# EAGLE design res-standalone (EAGLE 6.5.0)
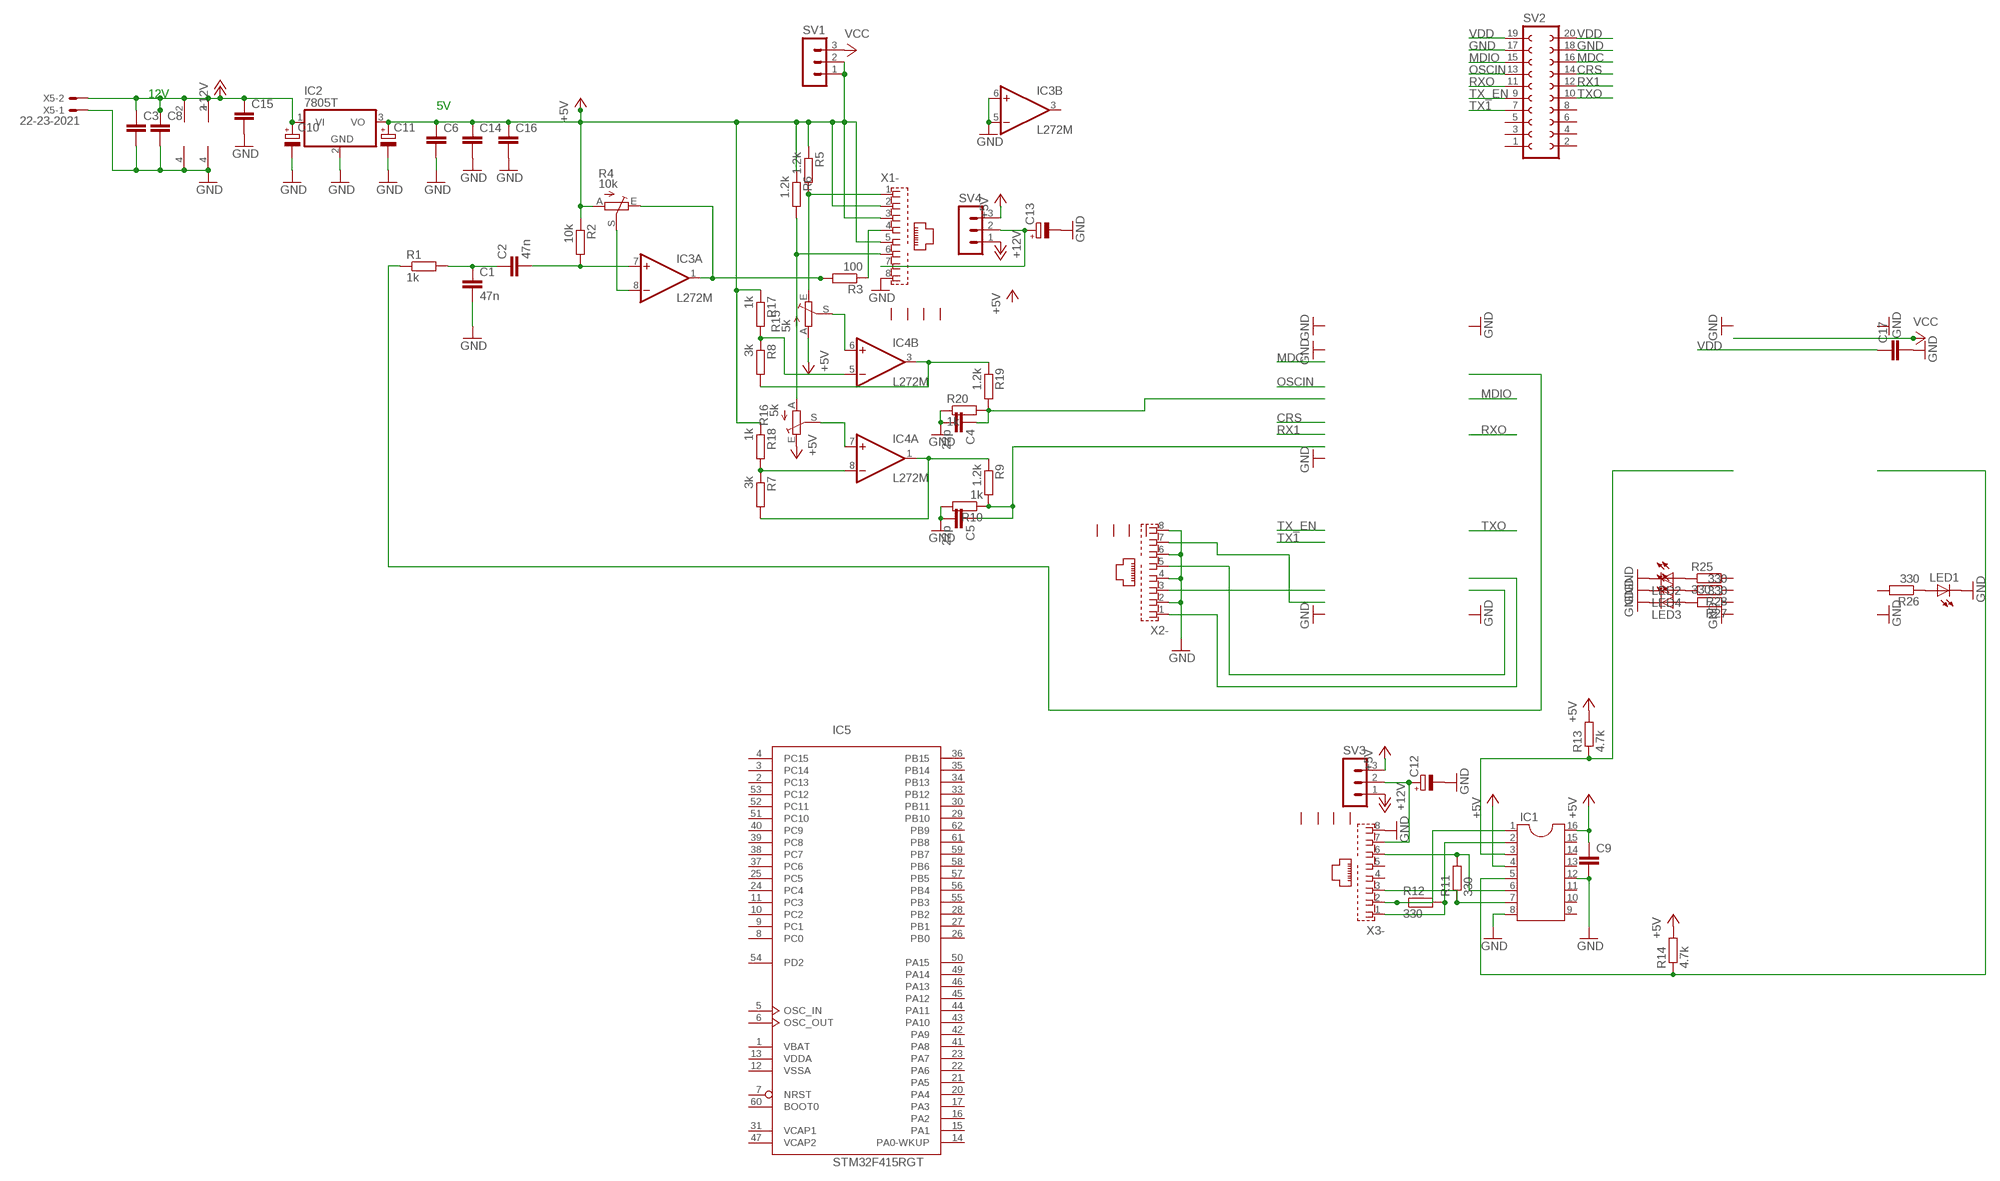
[diagram p0: schematic, sheet 1]

## Parts
C1  47n  C-EU050-025X075  [C050-025X075]
C2  47n  C-EU050-025X075  [C050-025X075]
C3  C-EU050-025X075  [C050-025X075]
C4  22p  C-EU050-025X075  [C050-025X075]
C5  22p  C-EU050-025X075  [C050-025X075]
C6  C-EU050-025X075  [C050-025X075]
C8  C-EU050-025X075  [C050-025X075]
C9  C-EU050-025X075  [C050-025X075]
C10  CPOL-EUE2.5-5  [E2,5-5]
C11  CPOL-EUE2.5-5  [E2,5-5]
C12  CPOL-EUE2.5-5  [E2,5-5]
C13  CPOL-EUE2.5-5  [E2,5-5]
C14  C-EU050-025X075  [C050-025X075]
C15  C-EU050-025X075  [C050-025X075]
C16  C-EU050-025X075  [C050-025X075]
C17  C-EU050-025X075  [C050-025X075]
IC1  DIL16  [DIL16]
IC2  7805T  [TO220H]
IC3  L272M  [DIL08]
IC4  L272M  [DIL08]
IC5  STM32F415RGT  [LQFP64]
LED1  LED3MM  [LED3MM]
LED2  LED3MM  [LED3MM]
LED3  LED3MM  [LED3MM]
LED4  LED3MM  [LED3MM]
R1  1k  R-EU_0204/7  [0204/7]
R2  10k  R-EU_0204/7  [0204/7]
R3  100  R-EU_0204/7  [0204/7]
R4  10k  TRIM_EU-CA6V  [CA6V]
R5  1.2k  R-EU_0204/7  [0204/7]
R6  1.2k  R-EU_0204/7  [0204/7]
R7  3k  R-EU_0204/7  [0204/7]
R8  3k  R-EU_0204/7  [0204/7]
R9  1.2k  R-EU_0204/7  [0204/7]
R10  1k  R-EU_0204/7  [0204/7]
R11  330  R-EU_0204/7  [0204/7]
R12  330  R-EU_0204/7  [0204/7]
R13  4.7k  R-EU_0204/7  [0204/7]
R14  4.7k  R-EU_0204/7  [0204/7]
R15  5k  TRIM_EU-CA6V  [CA6V]
R16  5k  TRIM_EU-CA6V  [CA6V]
R17  1k  R-EU_0204/7  [0204/7]
R18  1k  R-EU_0204/7  [0204/7]
R19  1.2k  R-EU_0204/7  [0204/7]
R20  1k  R-EU_0204/7  [0204/7]
R25  330  R-EU_0204/7  [0204/7]
R26  330  R-EU_0204/7  [0204/7]
R27  330  R-EU_0204/7  [0204/7]
R28  330  R-EU_0204/7  [0204/7]
SV1  MA03-1  [MA03-1]
SV2  FE10-2W  [FE10-2W]
SV3  MA03-1  [MA03-1]
SV4  MA03-1  [MA03-1]
X1  RJ45  [RJ45]
X2  RJ45  [RJ45]
X3  RJ45  [RJ45]
X5  22-23-2021  [22-23-2021]

## Nets
+5V: C6.1 C9.1 C11.+ C14.1 C16.1 IC1.4 IC1.16 IC2.3(VO) R2.1 R4.A R5.1 R6.1 R13.2 R14.2 R15.A R16.E R17.1 R18.1 SV1.1 SV1.2 SV3.3 SV4.3 X1.2 X1.3 X1.5
+12V: C3.1 C8.1 C10.+ C15.1 IC2.1(VI) IC3.2(P:V+) IC4.2(P:V+) SV3.1 SV4.1 X5.2
CRS: SV2.14
GND: C1.2 C3.2 C4.2 C5.2 C6.2 C8.2 C9.2 C10.- C11.- C12.- C13.- C14.2 C15.2 C16.2 C17.2 IC1.8 IC1.12 IC2.2(GND) IC3.4(P:GND) IC3.5(B:-IN) IC3.6(B:+IN) IC4.4(P:GND) LED1.K(C) LED2.K(C) LED3.K(C) LED4.K(C) R10.2 R20.1 SV2.17 SV2.18 X1.8 X2.2 X2.4 X2.6 X2.8 X3.8 X5.1
MDC: SV2.16
MDIO: SV2.15
N$1: IC3.8(A:-IN) R4.S
N$2: IC3.1(A:OUT) R3.2 R4.E
N$3: C2.2 IC3.7(A:+IN) R2.2
N$4: R1.1
N$5: C1.1 C2.1 R1.2
N$6: R3.1 X1.4
N$8: R6.2 R16.A X1.6
N$9: R5.2 R15.E X1.1
N$10: IC4.5(B:-IN) R8.1 R17.2
N$11: IC4.8(A:-IN) R7.1 R18.2
N$12: IC4.3(B:OUT) R8.2 R19.1
N$13: IC4.1(A:OUT) R7.2 R9.1
N$14: X2.7
N$15: C12.+ SV3.2 X3.7
N$16: X2.1
N$17: IC1.6 R11.2 X3.6
N$18: X2.5
N$19: X2.3
N$20: C4.1 R19.2 R20.2
N$21: IC4.6(B:+IN) R15.S
N$22: IC1.3 R13.1
N$23: IC1.5 R14.1
N$24: IC1.2 R12.2 X3.1
N$25: IC1.1 R12.1 X3.2
N$26: IC1.7 R11.1 X3.3
N$27: C13.+ SV4.2 X1.7
N$28: IC4.7(A:+IN) R16.S
N$40: C5.1 R9.2 R10.1
N$46: LED2.A R25.1
N$50: LED1.A R26.1
N$52: LED3.A R27.2
N$53: LED4.A R28.2
OSCIN: SV2.13
RX1: SV2.12
RXO: SV2.11
TX1: SV2.7
TX_EN: SV2.9
TXO: SV2.10
VCC: SV1.3
VDD: C17.1 SV2.19 SV2.20
Unconnected: IC1.9 IC1.10 IC1.11 IC1.13 IC1.14 IC1.15 IC3.3(B:OUT) IC5.2(PC13) IC5.3(PC14) IC5.4(PC15) IC5.5(OSC_IN) IC5.6(OSC_OUT) IC5.7(NRST) IC5.8(PC0) IC5.9(PC1) IC5.10(PC2) IC5.11(PC3) IC5.14(PA0-WKUP) IC5.15(PA1) IC5.16(PA2) IC5.17(PA3) IC5.20(PA4) IC5.21(PA5) IC5.22(PA6) IC5.23(PA7) IC5.24(PC4) IC5.25(PC5) IC5.26(PB0) IC5.27(PB1) IC5.28(PB2) IC5.29(PB10) IC5.30(PB11) IC5.33(PB12) IC5.34(PB13) IC5.35(PB14) IC5.36(PB15) IC5.37(PC6) IC5.38(PC7) IC5.39(PC8) IC5.40(PC9) IC5.41(PA8) IC5.42(PA9) IC5.43(PA10) IC5.44(PA11) IC5.45(PA12) IC5.46(PA13) IC5.49(PA14) IC5.50(PA15) IC5.51(PC10) IC5.52(PC11) IC5.53(PC12) IC5.54(PD2) IC5.55(PB3) IC5.56(PB4) IC5.57(PB5) IC5.58(PB6) IC5.59(PB7) IC5.60(BOOT0) IC5.61(PB8) IC5.62(PB9) R25.2 R26.2 R27.1 R28.1 SV2.1 SV2.2 SV2.3 SV2.4 SV2.5 SV2.6 SV2.8 X1.G1 X1.G2 X1.G3 X1.G4 X2.G1 X2.G2 X2.G3 X2.G4 X3.4 X3.5 X3.G1 X3.G2 X3.G3 X3.G4

## Notes on the sheet
- 12V
- 5V

## Power pins joined to a net without a drawn wire
VBAT: IC5.1(VBAT)
VCAP1: IC5.31(VCAP1)
VCAP2: IC5.47(VCAP2)
VDD: IC5.19(VDD) IC5.32(VDD) IC5.48(VDD) IC5.64(VDD)
VDDA: IC5.13(VDDA)
VSS: IC5.18(VSS) IC5.63(VSS)
VSSA: IC5.12(VSSA)

## Library data of the parts
C1-C6 C8 C9 C14-C17 = rcl:C-EU: CAPACITOR, European symbol
C10-C13 = rcl:CPOL-EU: POLARIZED CAPACITOR, European symbol
IC1 = ic-package:DIL16: Dual In Line / Socket
IC2 = linear:78*: Positive VOLTAGE REGULATOR Source: http://cache.national.com/ds/LM/LM78L05.pdf http://www.fairchildsemi.com/ds/LM/LM7805.pdf
IC3 IC4 = linear:L272: OP AMP
IC5 = micro-stm_v2:STM32F415R*T: ARM 32-bit Cortex™-M3 CPU 168 MHz maximum frequency 1024 Kbytes of Flash memory 192 kbytes of SRAM 51 GPIOs 1.8 to 3.6 V application supply
LED1-LED4 = led:LED: LED OSRAM: - CHIPLED LG R971, LG N971, LY N971, LG Q971, LY Q971, LO R971, LY R971 LH N974, LH R974 LS Q976, LO Q976, LY Q976 LO Q996 - Hyper CHIPLED LW Q18S LB Q993, LB Q99A, LB R99A - SideLED LS A670, LO A670, LY A670, LG A670, LP A670 LB A673, LV A673, LT A673, LW A673 LH A674 LY A675 LS A676, LA A676, LO A676, LY A676, LW A676 LS A679, LY A679, LG A679 - Hyper Micro SIDELED® LS Y876, LA Y876, LO Y876, LY Y876 LT Y87S - SmartLED LW L88C, LW L88S LB L89C, LB L89S, LG L890 LS L89K, LO L89K, LY L89K LS L896, LA L896, LO L896, LY L896 - TOPLED LS T670, LO T670, LY T670, LG T670, LP T670 LSG T670, LSP T670, LSY T670, LOP T670, LYG T670 LG T671, LOG T671, LSG T671 LB T673, LV T673, LT T673, LW T673 LH T674 LS T676, LA T676, LO T676, LY T676, LB T676, LH T676, LSB T676, LW T676 LB T67C, LV T67C, LT T67C, LS T67K, LO T67K, LY T67K, LW E67C LS E67B, LA E67B, LO E67B, LY E67B, LB E67C, LV E67C, LT E67C LW T67C LS T679, LY T679, LG T679 LS T770, LO T770, LY T770, LG T770, LP T770 LB T773, LV T773, LT T773, LW T773 LH T774 LS E675, LA E675, LY E675, LS T675 LS T776, LA T776, LO T776, LY T776, LB T776 LHGB T686 LT T68C, LB T68C - Hyper Mini TOPLED® LB M676 - Mini TOPLED Santana® LG M470 LS M47K, LO M47K, LY M47K Source: http://www.osram.convergy.de LUXEON: - LUMILED® LXK2-PW12-R00, LXK2-PW12-S00, LXK2-PW14-U00, LXK2-PW14-V00 LXK2-PM12-R00, LXK2-PM12-S00, LXK2-PM14-U00 LXK2-PE12-Q00, LXK2-PE12-R00, LXK2-PE12-S00, LXK2-PE14-T00, LXK2-PE14-U00 LXK2-PB12-K00, LXK2-PB12-L00, LXK2-PB12-M00, LXK2-PB14-N00, LXK2-PB14-P00, LXK2-PB14-Q00 LXK2-PR12-L00, LXK2-PR12-M00, LXK2-PR14-Q00, LXK2-PR14-R00 LXK2-PD12-Q00, LXK2-PD12-R00, LXK2-PD12-S00 LXK2-PH12-R00, LXK2-PH12-S00 LXK2-PL12-P00, LXK2-PL12-Q00, LXK2-PL12-R00 Source: www.luxeon.com KINGBRIGHT: KA-3528ASYC Source: www.kingbright.com
R1-R3 R5-R14 R17-R20 R25-R28 = resistor:R-EU_: RESISTOR, European symbol
R4 R15 R16 = pot:TRIM_EU-: POTENTIOMETER
SV1 SV3 SV4 = con-lstb:MA03-1: PIN HEADER; OC_FARNELL: unknown; OC_NEWARK: unknown
SV2 = con-lsta:FE10-2W: FEMALE HEADER; OC_FARNELL: unknown; OC_NEWARK: unknown
X1-X3 = con-appsys:RJ45: AMP connector
X5 = con-molex:22-23-2021: .100" (2.54mm) Center Header - 2 Pin; MF: MOLEX; MPN: 22-23-2021; OC_FARNELL: 1462926; OC_NEWARK: 25C3832

## Net classes
0 default: clearance 0.205 mm

## Board
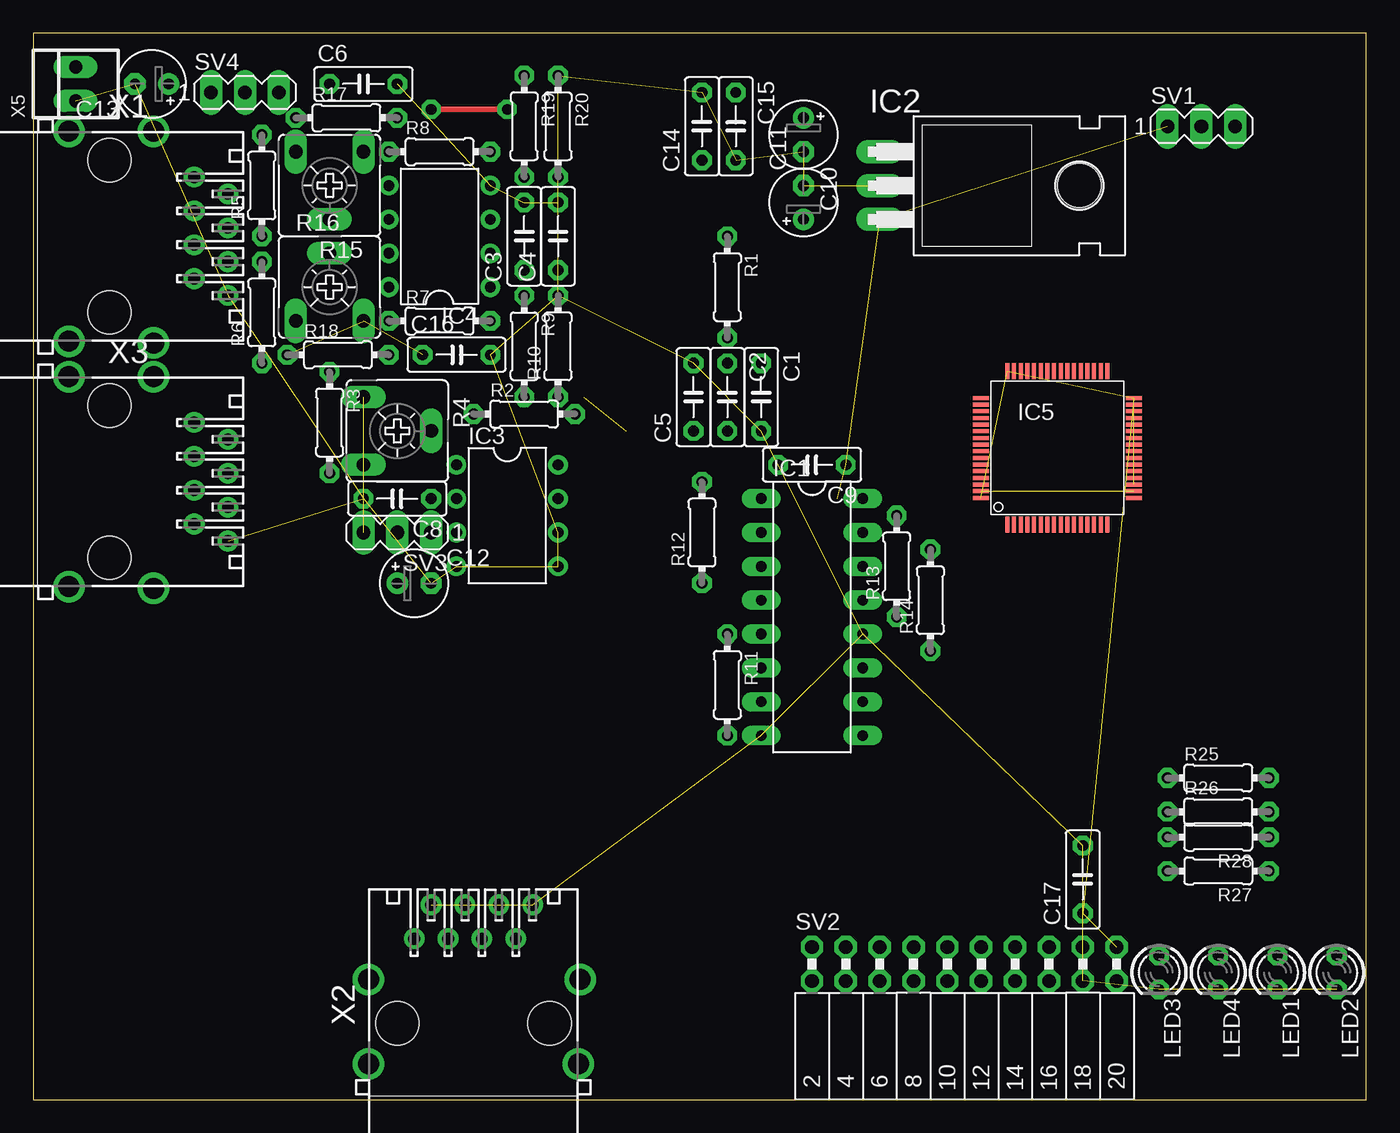
[diagram p1: board, top side]
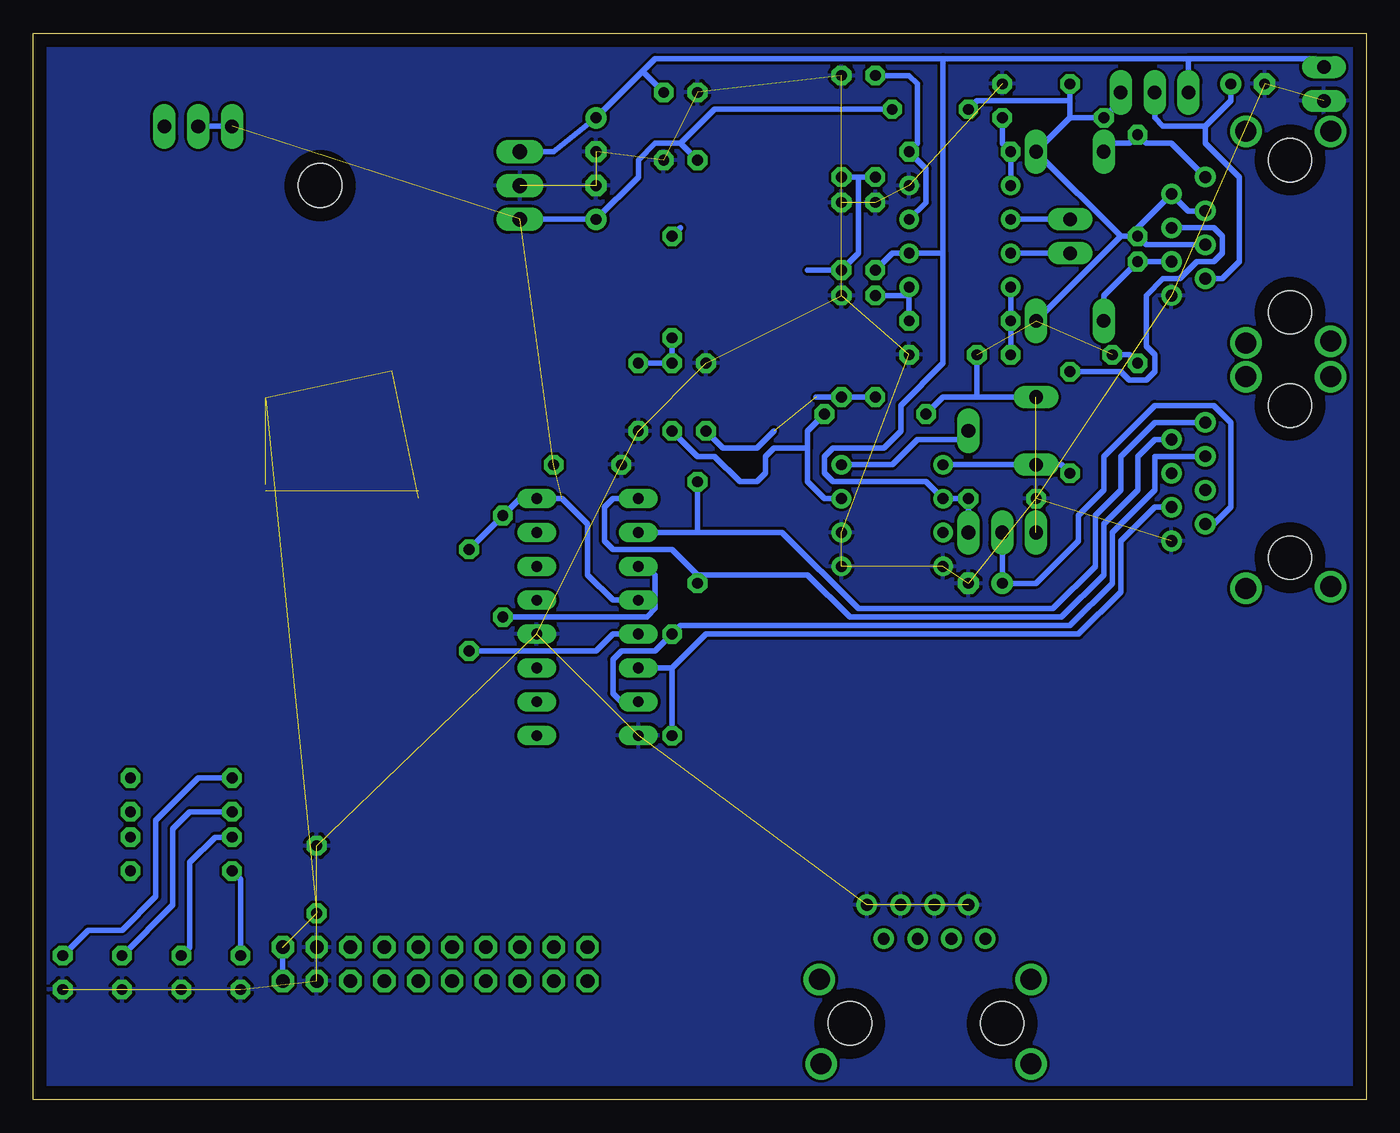
[diagram p2: board, bottom side, seen from below]

Size 100 x 80 mm. Coordinates in mm from the lower left corner, seen from the top.
Outline: 0,0 100,0 100,80 0,80 0,0
Copper layers (1*16): Top 0.035mm / dielectric 1.5mm / Bottom 0.035mm
Design rules "default *": minimum track width 10mil, minimum drill 31mil, track to track 8mil, track to pad 8mil, pad to pad 8mil, via to via 8mil, smd to smd 8mil, copper to edge 40mil, drill to drill 8mil, minimum pad ring 13mil, minimum via ring 8mil, stop-mask expansion 4mil, vias tented up to drill 0mil, thermal gap 10mil

### Footprints (pad centres in the part's own frame; a part is rotated, then mirrored left to right if it is on the bottom)
C050-025X075 = drill 0.813 octagon: 1 -2.54,0; 2 2.54,0
E2,5-5 = drill 0.813 pad 1.6: + -1.27,0 | drill 0.813 pad 1.6 octagon: - 1.27,0
DIL16 = drill 0.813 long: 1 -8.89,-3.81; 2 -6.35,-3.81; 3 -3.81,-3.81; 4 -1.27,-3.81; 5 1.27,-3.81; 6 3.81,-3.81; 7 6.35,-3.81; 8 8.89,-3.81; 9 8.89,3.81; 10 6.35,3.81; 11 3.81,3.81; 12 1.27,3.81; 13 -1.27,3.81; 14 -3.81,3.81; 15 -6.35,3.81; 16 -8.89,3.81
TO220H = drill 1.118 long: 1 -2.54,-10.16; 2 0,-10.16; 3 2.54,-10.16 | hole 3.302: 0,4.826
DIL08 = drill 0.813 pad 1.27: 1 -3.81,-3.81; 2 -1.27,-3.81; 3 1.27,-3.81; 4 3.81,-3.81; 5 3.81,3.81; 6 1.27,3.81; 7 -1.27,3.81; 8 -3.81,3.81
LQFP64 = smd 0.3 x 1.2: 1 -3.75,-5.75; 2 -3.25,-5.75; 3 -2.75,-5.75; 4 -2.25,-5.75; 5 -1.75,-5.75; 6 -1.25,-5.75; 7 -0.75,-5.75; 8 -0.25,-5.75; 9 0.25,-5.75; 10 0.75,-5.75; 11 1.25,-5.75; 12 1.75,-5.75; 13 2.25,-5.75; 14 2.75,-5.75; 15 3.25,-5.75; 16 3.75,-5.75; 33 3.75,5.75; 34 3.25,5.75; 35 2.75,5.75; 36 2.25,5.75; 37 1.75,5.75; 38 1.25,5.75; 39 0.75,5.75; 40 0.25,5.75; 41 -0.25,5.75; 42 -0.75,5.75; 43 -1.25,5.75; 44 -1.75,5.75; 45 -2.25,5.75; 46 -2.75,5.75; 47 -3.25,5.75; 48 -3.75,5.75 | smd 1.2 x 0.3: 17 5.75,-3.75; 18 5.75,-3.25; 19 5.75,-2.75; 20 5.75,-2.25; 21 5.75,-1.75; 22 5.75,-1.25; 23 5.75,-0.75; 24 5.75,-0.25; 25 5.75,0.25; 26 5.75,0.75; 27 5.75,1.25; 28 5.75,1.75; 29 5.75,2.25; 30 5.75,2.75; 31 5.75,3.25; 32 5.75,3.75; 49 -5.75,3.75; 50 -5.75,3.25; 51 -5.75,2.75; 52 -5.75,2.25; 53 -5.75,1.75; 54 -5.75,1.25; 55 -5.75,0.75; 56 -5.75,0.25; 57 -5.75,-0.25; 58 -5.75,-0.75; 59 -5.75,-1.25; 60 -5.75,-1.75; 61 -5.75,-2.25; 62 -5.75,-2.75; 63 -5.75,-3.25; 64 -5.75,-3.75
LED3MM = drill 0.813 octagon: A -1.27,0; K 1.27,0
0204/7 = drill 0.813 octagon: 1 -3.81,0; 2 3.81,0
CA6V = drill 1.016 long: A -2.54,-2.54; E 2.54,-2.54; S 0,2.54
MA03-1 = drill 1.016 long: 1 -2.54,0; 2 0,0; 3 2.54,0
FE10-2W = drill 1.016 octagon: 1 -11.43,1.27; 2 -11.43,-1.27; 3 -8.89,1.27; 4 -8.89,-1.27; 5 -6.35,1.27; 6 -6.35,-1.27; 7 -3.81,1.27; 8 -3.81,-1.27; 9 -1.27,1.27; 10 -1.27,-1.27; 11 1.27,1.27; 12 1.27,-1.27; 13 3.81,1.27; 14 3.81,-1.27; 15 6.35,1.27; 16 6.35,-1.27; 17 8.89,1.27; 18 8.89,-1.27; 19 11.43,1.27; 20 11.43,-1.27
RJ45 = drill 0.889: 1 -4.445,6.35; 2 -3.175,8.89; 3 -1.905,6.35; 4 -0.635,8.89; 5 0.635,6.35; 6 1.905,8.89; 7 3.175,6.35; 8 4.445,8.89 | drill 1.575 pad 2.184: G1 -7.874,-3.048; G2 7.874,-3.048; G3 -7.874,3.302; G4 8.001,3.302 | hole 3.251: -5.715,0; 5.715,0
22-23-2021 = drill 1 long: 1 -1.27,0; 2 1.27,0

### Placement (x,y rotation side)
C1  54.61,52.7 270 top
C2  52.07,52.7 270 top
C3  36.83,64.77 90 top
C4  39.37,64.77 90 top
C5  49.53,52.7 90 top
C6  24.77,76.2 0 top
C8  27.3,45.08 180 top
C9  58.42,47.62 180 top
C10  57.78,72.39 270 top
C11  57.78,67.31 90 top
C12  28.57,38.73 0 top
C13  8.89,76.2 180 top
C14  50.16,73.03 90 top
C15  52.7,73.03 270 top
C16  31.75,55.88 0 top
C17  78.74,16.51 90 top
IC1  58.42,36.2 270 top
IC2  73.66,68.58 270 top
IC3  35.56,43.81 270 top
IC4  30.48,64.77 90 top
IC5  76.83,48.89 0 top
LED1  93.34,9.53 270 top
LED2  97.79,9.53 270 top
LED3  84.45,9.53 270 top
LED4  88.9,9.53 270 top
R1  52.07,60.96 270 top
R2  36.83,51.43 0 top
R3  22.23,50.8 270 top
R4  27.3,50.16 270 top
R5  17.14,68.58 90 top
R6  17.14,59.05 90 top
R7  30.48,58.42 0 top
R8  30.48,71.12 0 top
R9  36.83,56.51 270 top
R10  39.37,56.51 90 top
R11  52.07,31.11 270 top
R12  50.16,42.54 90 top
R13  64.77,40 90 top
R14  67.31,37.46 90 top
R15  22.23,68.58 180 top
R16  22.23,60.96 0 top
R17  23.5,73.66 0 top
R18  22.86,55.88 0 top
R19  36.83,73.03 270 top
R20  39.37,73.03 270 top
R25  88.9,24.13 0 top
R26  88.9,21.59 0 top
R27  88.9,17.14 180 top
R28  88.9,19.68 180 top
SV1  87.63,73.03 0 top
SV2  69.85,10.16 0 top
SV3  27.3,42.54 180 top
SV4  15.88,75.56 0 top
X1  5.71,64.77 270 top
X2  33.02,5.71 0 top
X3  5.71,46.35 270 top
X5  3.17,76.2 90 top

### Tracks (layer width: path | path; a pad name or v marks a point on that pad's centre or on a via)
+5V  (via drill 0.8 pad 1.42)  (6 unrouted)
  Top 0.406: v35.56,74.3 v29.84,74.3
  Bottom 0.406: SV1.2 SV1.1 | IC1.4 56.52,37.46 58.42,39.37 58.42,43.18 60.33,45.08 IC1.16 63.5,45.08 R13.2 R14.2 | X1.3 13.34,66.67 X1.2 17.78,64.77 | 17.78,64.77 18.41,64.77 | X1.5 16.51,64.14 R5.1 17.78,64.77 | R18.1 17.78,55.88 R6.1 | 22.23,73.66 22.23,74.93 | 22.23,74.93 C6.1 | IC2.3 C11.+ 54.61,69.22 54.61,70.48 53.34,71.76 51.44,71.76 | R2.1 31.75,52.7 29.21,52.7 | C14.1 51.44,71.76 | 51.44,71.76 48.9,74.3 v35.56,74.3 | SV4.3 18.41,74.93 R17.1 22.23,73.66 | R4.A 29.21,52.7 | 22.23,74.93 29.21,74.93 v29.84,74.3 | C16.1 29.21,52.7 | 22.23,73.66 R15.A 18.41,64.77 | 18.41,64.77 R16.E
+12V
  Bottom 0.406: SV3.1 C8.1 IC3.2 33.02,46.35 40.01,46.35 40.64,46.99 40.64,48.26 40.01,48.89 36.2,48.89 34.92,50.16 34.92,52.07 31.75,55.24 31.75,63.5 | 31.75,63.5 31.75,78.11 | IC2.1 60.96,71.12 C10.+ 54.29,77.15 | 54.29,77.15 53.34,78.11 31.75,78.11 | 31.75,63.5 IC4.2 35.56,63.5 C3.1 | 31.75,78.11 13.34,78.11 | 13.34,78.11 SV4.1 | C15.1 54.29,77.15 | X5.2 3.81,78.11 13.34,78.11
GND  (36 unrouted)
  pour Bottom: 0,80.65 101.6,80.65 100.97,-0.64 -0.64,-0.64
N$1
  Bottom 0.406: IC3.8 35.56,47.62 33.66,49.53 30.48,49.53 R4.S
N$2
  Bottom 0.406: R3.2 22.86,47.62 R4.E IC3.1
N$3
  Bottom 0.406: R2.2 41.91,50.16 41.91,48.89 | C2.2 50.16,48.26 48.9,48.26 46.99,46.35 45.72,46.35 45.09,46.99 45.09,48.26 44.45,48.89 41.91,48.89 | IC3.7 40.64,45.08 41.91,46.35 41.91,48.89
N$4
  Bottom 0.406: 51.44,65.41 R1.1
N$5
  Bottom 0.406: C1.1 C2.1 R1.2
N$6
  Bottom 0.406: X1.4 11.43,65.41 10.79,64.77 10.79,63.5 11.43,62.87 12.7,62.87 13.97,61.59 15.24,61.59 16.51,60.32 16.51,56.51 15.88,55.88 15.88,54.61 16.51,53.97 17.78,53.97 18.41,54.61 R3.1
N$8
  Bottom 0.406: R16.A 19.68,60.32 R6.2 X1.6
N$9
  Bottom 0.406: X1.1 14.61,71.76 16.51,71.76 R5.2 17.78,71.76 19.05,71.76 R15.E
N$10
  Bottom 0.406: IC4.5 R8.1 27.3,71.76 R17.2
N$11
  Bottom 0.406: IC4.8 R7.1 R18.2
N$12
  Bottom 0.406: IC4.3 33.02,67.31 33.02,69.85 R8.2 33.66,71.76 33.66,76.2 34.29,76.84 R19.1
N$13
  Bottom 0.406: IC4.1 34.29,60.32 | 34.29,60.32 R7.2 | R9.1 34.29,60.32
N$15
  Bottom 0.406: X3.7 11.43,43.18 10.16,44.45 10.16,50.8 11.43,52.07 15.88,52.07 19.68,48.26 19.68,45.72 21.59,43.81 21.59,41.91 24.77,38.73 C12.+ SV3.2
N$17
  Bottom 0.406: X3.6 15.88,44.45 18.41,41.91 18.41,38.1 21.59,34.92 49.53,34.92 52.07,32.38 | 52.07,32.38 IC1.6 | R11.2 52.07,32.38
N$20
  Bottom 0.406: 41.91,62.23 C4.1 38.1,63.5 38.1,69.22 | R19.2 38.1,69.22 | 38.1,69.22 R20.2
N$21
  Bottom 0.406: R15.S IC4.6
N$22
  Bottom 0.406: IC1.3 53.98,40 53.34,39.37 53.34,36.83 53.98,36.2 R13.1
N$23
  Bottom 0.406: R14.1 57.78,33.65 56.52,34.92 IC1.5
N$24
  Bottom 0.406: X3.1 15.88,50.8 18.41,48.26 18.41,45.72 20.32,43.81 20.32,40 23.5,36.83 38.1,36.83 43.81,42.54 50.16,42.54 | 50.16,42.54 R12.2 | IC1.2 50.16,42.54
N$25
  Bottom 0.406: X3.2 15.88,49.53 17.14,48.26 17.14,45.72 19.68,43.18 19.68,39.37 22.86,36.2 38.73,36.2 41.91,39.37 50.16,39.37 | IC1.1 56.52,45.08 57.15,44.45 57.15,41.91 56.52,41.27 52.07,41.27 50.16,39.37 | R12.1 50.16,39.37
N$26
  Bottom 0.406: X3.3 15.88,48.26 15.88,45.72 19.05,42.54 19.05,38.73 22.23,35.56 51.44,35.56 R11.1 53.34,33.65 55.88,33.65 56.52,33.02 56.52,30.48 55.88,29.84 IC1.7
N$27
  Bottom 0.406: X1.7 10.79,61.59 9.53,62.87 9.53,69.22 12.06,71.76 12.06,73.03 | SV4.2 15.88,73.66 15.24,73.03 12.06,73.03 | 12.06,73.03 10.16,74.93 C13.+
N$28
  Bottom 0.406: R16.S IC4.7
N$40  (1 unrouted)
  Bottom 0.406: C5.1 48.26,48.89 45.72,48.89 44.45,50.16 | 41.27,52.7 R10.1 R9.2
N$46
  Bottom 0.406: R25.1 87.63,24.13 90.81,20.96 90.81,15.24 93.34,12.7 95.89,12.7 LED2.A
N$50
  Bottom 0.406: R26.1 88.27,21.59 89.53,20.32 89.53,14.61 LED1.A
N$52
  Bottom 0.406: LED3.A 84.45,16.51 R27.2
N$53
  Bottom 0.406: R28.2 86.36,19.68 88.27,17.78 88.27,11.43 LED4.A
VDD  (5 unrouted)
  Bottom 0.406: SV2.20 SV2.19
VSS  (1 unrouted)